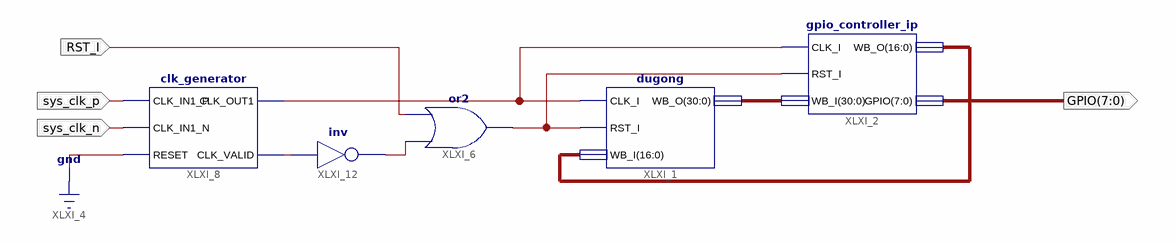
[diagram p0: schematic sheet 1]
// Xilinx ISE schematic prototype0.sch (spartan6) as structural Verilog: 5 symbols, 4 ports
module prototype0 (
  input  RST_I,
  input  sys_clk_p,
  input  sys_clk_n,
  output [7:0] GPIO
);

  wire XLXN_10, XLXN_15, XLXN_30, XLXN_31;
  wire [16:0] XLXN_21;
  wire [30:0] XLXN_16;

  dugong XLXI_1 (.CLK_I(XLXN_31), .RST_I(XLXN_15), .WB_I(XLXN_21), .WB_O(XLXN_16));
  gpio_controller_ip XLXI_2 (.CLK_I(XLXN_31), .RST_I(XLXN_15), .WB_I(XLXN_16), .WB_O(XLXN_21), .GPIO(GPIO));
  or XLXI_6 (XLXN_15, XLXN_10, RST_I);
  clk_generator XLXI_8 (
    .CLK_IN1_P(sys_clk_p), .CLK_IN1_N(sys_clk_n), .RESET(1'b0), .CLK_OUT1(XLXN_31), .CLK_VALID(XLXN_30));
  not XLXI_12 (XLXN_10, XLXN_30);
endmodule
